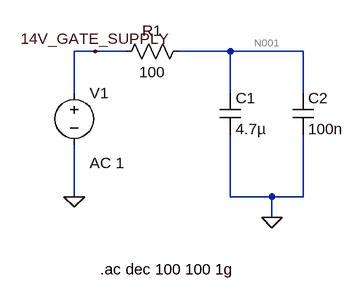
[diagram p0: schematic Draft26.asc]
Draft26.asc, the LTspice schematic file:
Version 4.1
SHEET 1 880 680
WIRE 112 80 80 80
WIRE 160 80 112 80
WIRE 320 80 240 80
WIRE 432 80 320 80
WIRE 80 144 80 80
WIRE 320 144 320 80
WIRE 432 144 432 80
WIRE 80 304 80 224
WIRE 320 304 320 208
WIRE 384 304 320 304
WIRE 432 304 432 208
WIRE 432 304 384 304
WIRE 384 336 384 304
FLAG 384 336 0
FLAG 80 304 0
FLAG 112 80 14V_GATE_SUPPLY
SYMBOL voltage 80 128 R0
WINDOW 123 24 124 Left 2
WINDOW 39 0 0 Left 0
SYMATTR InstName V1
SYMATTR Value ""
SYMATTR Value2 AC 1
SYMBOL cap 304 144 R0
SYMATTR InstName C1
SYMATTR Value 4.7µ
SYMATTR SpiceLine Rser=20m Lser=1.2n
SYMBOL cap 416 144 R0
SYMATTR InstName C2
SYMATTR Value 100n
SYMATTR SpiceLine Rser=50m Lser=0.8n
SYMBOL res 256 64 R90
WINDOW 0 0 56 VBottom 2
WINDOW 3 32 56 VTop 2
SYMATTR InstName R1
SYMATTR Value 100
TEXT 120 416 Left 2 !.ac dec 100 100 1g

The netlist it stands for:
* Draft26.asc
V1 14V_GATE_SUPPLY 0 AC 1
C1 N001 0 4.7µ Rser=20m Lser=1.2n
C2 N001 0 100n Rser=50m Lser=0.8n
R1 N001 14V_GATE_SUPPLY 100
.ac dec 100 100 1g
.backanno
.end

* Results of the author's LTspice run, read from the files saved beside the schematic
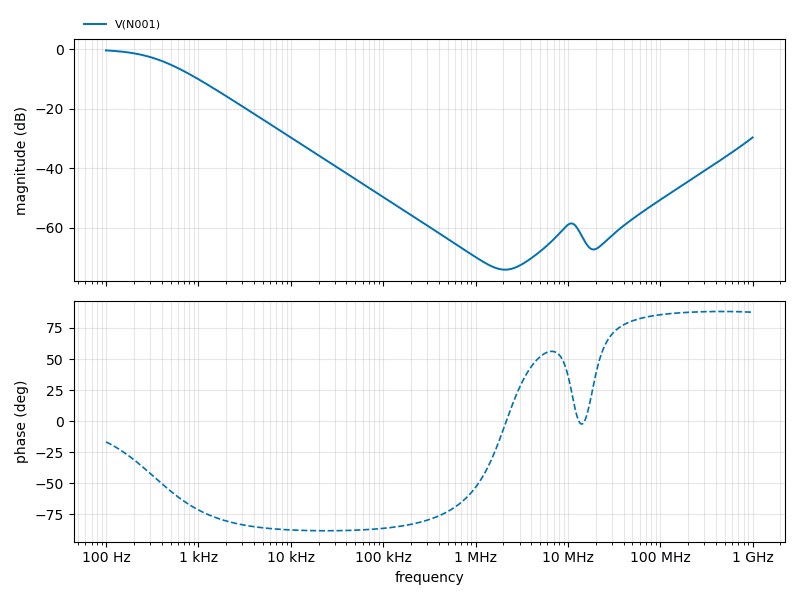
[diagram p1: AC Analysis of Draft26.asc, plotted from the saved traces]
* AC Analysis, 1 run:
*   V(N001): -0.38 dB at 100 Hz, -29.59 dB at 1 GHz, peak -0.38 dB at 100 Hz, 3 dB below the peak at 360.4 Hz